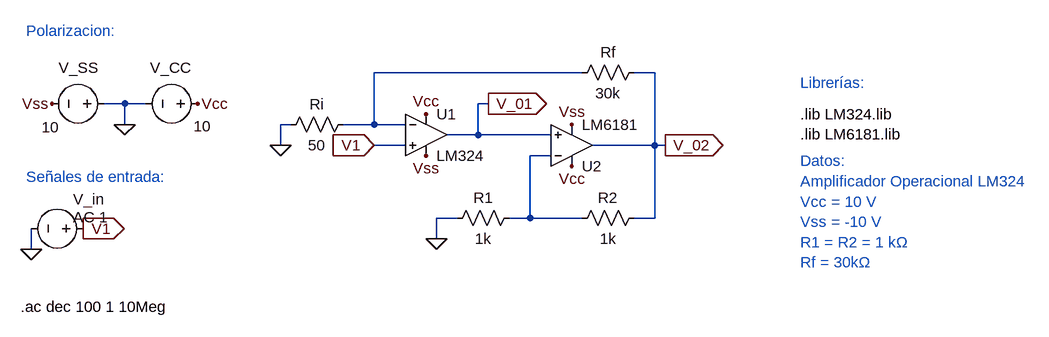
[diagram p0: schematic Lab_3_Circ_3.asc]
Lab_3_Circ_3.asc, the LTspice schematic file:
Version 4
SHEET 1 1652 680
WIRE 736 -304 416 -304
WIRE 848 -304 816 -304
WIRE 32 -256 0 -256
WIRE 64 -256 32 -256
WIRE 592 -256 576 -256
WIRE 32 -224 32 -256
WIRE 288 -224 272 -224
WIRE 416 -224 416 -304
WIRE 416 -224 368 -224
WIRE 464 -224 416 -224
WIRE 576 -208 576 -256
WIRE 576 -208 528 -208
WIRE 688 -208 576 -208
WIRE 272 -192 272 -224
WIRE 464 -192 416 -192
WIRE 848 -192 848 -304
WIRE 848 -192 752 -192
WIRE 864 -192 848 -192
WIRE 688 -176 656 -176
WIRE 544 -80 512 -80
WIRE 656 -80 656 -176
WIRE 656 -80 624 -80
WIRE 736 -80 656 -80
WIRE 848 -80 848 -192
WIRE 848 -80 816 -80
WIRE 512 -48 512 -80
WIRE -112 -32 -112 -64
FLAG 512 -48 0
FLAG 144 -256 Vcc
FLAG 496 -240 Vcc
FLAG -80 -256 Vss
FLAG 496 -176 Vss
FLAG 32 -224 0
FLAG -112 -32 0
FLAG 416 -192 V1
IOPIN 416 -192 In
FLAG -32 -64 V1
IOPIN -32 -64 Out
FLAG 864 -192 V_02
IOPIN 864 -192 Out
FLAG 720 -160 Vcc
FLAG 720 -224 Vss
FLAG 272 -192 0
FLAG 592 -256 V_01
IOPIN 592 -256 Out
SYMBOL OpAmps\\opamp2 496 -272 R0
SYMATTR InstName U1
SYMATTR Value LM324
SYMBOL res 640 -96 R90
WINDOW 0 0 56 VBottom 2
WINDOW 3 32 56 VTop 2
SYMATTR InstName R1
SYMATTR Value 1k
SYMBOL res 720 -64 R270
WINDOW 0 32 56 VTop 2
WINDOW 3 0 56 VBottom 2
SYMATTR InstName R2
SYMATTR Value 1k
SYMBOL res 832 -320 R90
WINDOW 0 0 56 VBottom 2
WINDOW 3 32 56 VTop 2
SYMATTR InstName Rf
SYMATTR Value 30k
SYMBOL res 272 -208 R270
WINDOW 0 32 56 VTop 2
WINDOW 3 0 56 VBottom 2
SYMATTR InstName Ri
SYMATTR Value 50
SYMBOL voltage -16 -64 M270
WINDOW 0 45 31 VLeft 2
WINDOW 3 1 -53 VLeft 2
WINDOW 123 17 31 VLeft 2
WINDOW 39 0 0 Left 0
SYMATTR InstName V_in
SYMATTR Value ""
SYMATTR Value2 AC 1
SYMBOL voltage 160 -256 R90
WINDOW 0 -55 25 VRight 2
WINDOW 3 35 -5 VRight 2
WINDOW 123 0 0 Left 0
WINDOW 39 0 0 Left 0
SYMATTR InstName V_CC
SYMATTR Value 10
SYMBOL voltage 16 -256 R90
WINDOW 0 -55 25 VRight 2
WINDOW 3 36 85 VRight 2
WINDOW 123 0 0 Left 0
WINDOW 39 0 0 Left 0
SYMATTR InstName V_SS
SYMATTR Value 10
SYMBOL OpAmps\\opamp2 720 -128 M180
SYMATTR InstName U2
SYMATTR Value LM6181
TEXT 1072 -240 Left 2 !.lib LM324.lib\n.lib LM6181.lib
TEXT 1072 -288 Left 2 ;Librerías:
TEXT -120 -368 Left 2 ;Polarizacion:
TEXT -120 -144 Left 2 ;Señales de entrada:
TEXT 1072 -168 Left 2 ;Datos:\nAmplificador Operacional LM324\nVcc = 10 V\nVss = -10 V\nR1 = R2 = 1 kΩ\nRf = 30kΩ
TEXT -128 56 Left 2 !.ac dec 100 1 10Meg

The netlist it stands for:
* Lab_3_Circ_3.asc
XU1 V1 N001 Vcc Vss V_01 LM324  ; pins In+ In- V+ V- OUT
R1 N002 0 1k
R2 N002 V_02 1k
Rf V_02 N001 30k
Ri 0 N001 50
V_in V1 0 AC 1
V_CC Vcc 0 10
V_SS 0 Vss 10
XU2 V_01 N002 Vcc Vss V_02 LM6181  ; pins In+ In- V+ V- OUT
.lib LM324.lib
.lib LM6181.lib
* Librerías:
* Polarizacion:
* Señales de entrada:
* Datos:
* Amplificador Operacional LM324
* Vcc = 10 V
* Vss = -10 V
* R1 = R2 = 1 kΩ
* Rf = 30kΩ
.ac dec 100 1 10Meg
.backanno
.end